# Altium schematic sheet 01_stm32.SchDoc: KART : STM32
size A4; DrawnBy: JNieto; DocumentNumber: 2; Revision: 1.0; SheetNumber: 2; SheetTotal: 10; Version: V 1.0.0
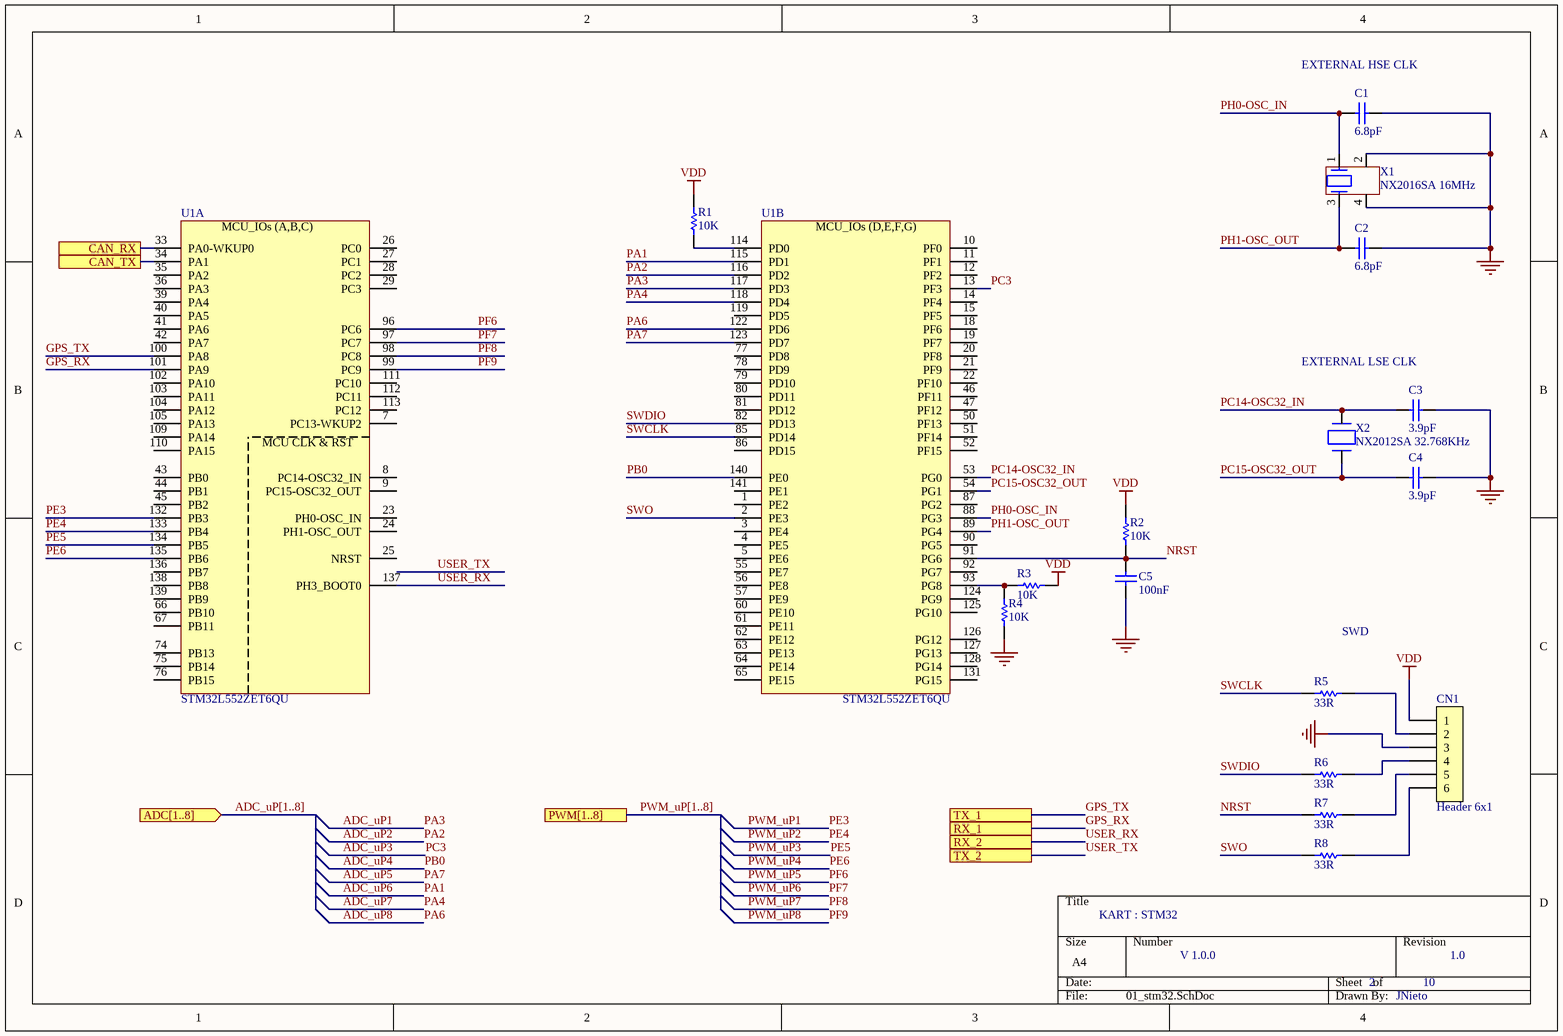
[diagram p0: 01_stm32.SchDoc]

## Parts
C1  value 6.8pF  [C0603]  (hidden comment: Capacitor)
C2  value 6.8pF  [C0603]  (hidden comment: Capacitor)
C3  value 3.9pF  [C0603]  (hidden comment: Capacitor)
C4  value 3.9pF  [C0603]  (hidden comment: Capacitor)
C5  value 100nF  [C0603]
CN1  value Header 6x1  [CON_SAMTEC_TSW-106-07-X-S]  (hidden comment: MCD-00212)
R1  value 10K  [R0603]
R2  value 10K  [R0603]
R3  value 10K  [R0603]
R4  value 10K  [R0603]
R5  value 33R  [R0603]  (hidden comment: MCD-00190)
R6  value 33R  [R0603]  (hidden comment: MCD-00190)
R7  value 33R  [R0603]  (hidden comment: MCD-00190)
R8  value 33R  [R0603]  (hidden comment: MCD-00190)
U1  STM32L552ZET6QU  [ICC_LQFP144_20X20_P050]  (parts A,B of 3)
X1  value NX2016SA 16MHz  [CRY_NX2016SA_4P]  (hidden comment: XTAL_4_PINS)
X2  value NX2012SA 32.768KHz  [CRY_NX2012SA_2P]  (hidden comment: XTAL_2_PINS)

## Ports
ADC[1..8] (in), CAN_RX, CAN_TX, PWM[1..8], RX_1, RX_2, TX_1, TX_2

## Nets
GND: C1.2 C2.2 C3.2 C4.2 C5.1 CN1.3 R4.2 X1.2 X1.4
VDD: CN1.1 R1.1 R2.1 R3.2
ADC_uP1: U1.117(PD3)  [also labelled PA3]
ADC_uP2: U1.116(PD2)  [also labelled PA2]
ADC_uP3: U1.13(PF3)  [also labelled PC3]
ADC_uP4: U1.140(PE0)  [also labelled PB0]
ADC_uP5: U1.123(PD7)  [also labelled PA7]
ADC_uP6: U1.115(PD1)  [also labelled PA1]
ADC_uP7: U1.118(PD4)  [also labelled PA4]
ADC_uP8: U1.122(PD6)  [also labelled PA6]
CAN_RX: U1.33(PA0-WKUP0) ; port CAN_RX
CAN_TX: U1.34(PA1) ; port CAN_TX
GPS_RX: U1.101(PA9) ; port RX_1
GPS_TX: U1.100(PA8) ; port TX_1
NRST: C5.2 R2.2 R7.1 U1.91(PG6)
PC14-OSC32_IN: C3.1 U1.53(PG0) X2.2(X2)
PC15-OSC32_OUT: C4.1 U1.54(PG1) X2.1(X1)
PE3: U1.132(PB3)  [also labelled PWM_uP1]
PE4: U1.133(PB4)  [also labelled PWM_uP2]
PE5: U1.134(PB5)  [also labelled PWM_uP3]
PE6: U1.135(PB6)  [also labelled PWM_uP4]
PF6: U1.96(PC6)  [also labelled PWM_uP5]
PF7: U1.97(PC7)  [also labelled PWM_uP6]
PF8: U1.98(PC8)  [also labelled PWM_uP7]
PF9: U1.99(PC9)  [also labelled PWM_uP8]
PH0-OSC_IN: C1.1 U1.88(PG3) X1.1
PH1-OSC_OUT: C2.1 U1.89(PG4) X1.3
SWCLK: R5.1 U1.85(PD14)
SWDIO: R6.1 U1.82(PD13)
SWO: R8.1 U1.2(PE3)
USER_RX: U1.137(PH3_BOOT0) ; port RX_2
USER_TX: port TX_2
NetCN1_2: CN1.2 R5.2
NetCN1_4: CN1.4 R6.2
NetCN1_5: CN1.5 R7.2
NetCN1_6: CN1.6 R8.2
NetR1_2: R1.2 U1.114(PD0)
NetR3_1: R3.1 R4.1 U1.93(PG8)

Not connected (* = marked no-connect by the designer): U1 1(PE2) 3(PE4) 4(PE5) 5(PE6) 7(PC13-WKUP2) 8(PC14-OSC32_IN) 9(PC15-OSC32_OUT) 10(PF0) 11(PF1) 12(PF2) 14(PF4) 15(PF5) 18(PF6) 19(PF7) 20(PF8) 21(PF9) 22(PF10) 23(PH0-OSC_IN) 24(PH1-OSC_OUT) 25(NRST) 26(PC0) 27(PC1) 28(PC2) 29(PC3) 35(PA2) 36(PA3) 39(PA4) 40(PA5) 41(PA6) 42(PA7) 43(PB0) 44(PB1) 45(PB2) 46(PF11) 47(PF12) 50(PF13) 51(PF14) 52(PF15) 55(PE7) 56(PE8) 57(PE9) 60(PE10) 61(PE11) 62(PE12) 63(PE13) 64(PE14) 65(PE15) 66(PB10) 67(PB11) 74(PB13) 75(PB14) 76(PB15) 77(PD8) 78(PD9) 79(PD10) 80(PD11) 81(PD12) 86(PD15) 87(PG2) 90(PG5) 92(PG7) 102(PA10) 103(PA11) 104(PA12) 105(PA13) 109(PA14) 110(PA15) 111(PC10) 112(PC11) 113(PC12) 119(PD5) 124(PG9) 125(PG10) 126(PG12) 127(PG13) 128(PG14) 131(PG15) 136(PB7) 138(PB8) 139(PB9) 141(PE1)

## Buses and harness runs
bus ADC_uP[1..8] = port ADC[1..8]
bus PWM_uP[1..8] = port PWM[1..8]

## Notes on the sheet
- (near C1) EXTERNAL HSE CLK
- EXTERNAL LSE CLK
- SWD
- (in symbol MCD-01055, part A) MCU_IOs (A,B,C); MCU CLK & RST
- (in symbol MCD-01055, part B) MCU_IOs (D,E,F,G)

## Library data of the parts
C1 C2 = MCD-00674: Capacitor, MLCC, 6.8pF, 50V, NPO, +-0.25pF, 0402, T=0.5mm; Manufacturer_Part_Number: CC0402CRNPO9BN6R8; Manufacturer: YAGEO; Provided_By: Subcon; Initial_Board_Reference: MB1319; Internal_Part_Number: MCD-00674; Status: Released; Part_Type: Capacitor; Package: C0402; ComponentLink1Description: Datasheet; ComponentLink1URL: http://tunmcdsvn.tun.st.com/Component_Datasheet_Library/Trunk/Capacitors/Yageo_Capacitor_NP0_16V-to-50V
C3 C4 = MCD-00556: Capacitor, MLCC, 3.9pF, 50V, NPO, +-0.25pF, 0402, T=0,5mm; Manufacturer_Part_Number: CC0402CRNPO9BN3R9; Manufacturer: YAGEO; ECCN_US: EAR99; ECCN_EU: NEC; Provided_By: SUBCO; Internal_Part_Number: MCD-00556; Status: Released; Part_Type: Capacitor; Package: C0402; ComponentLink1Description: Datasheet; ComponentLink1URL: http://tunmcdsvn.tun.st.com/Component_Datasheet_Library/Trunk/Capacitors/Yageo_Capacitor_NP0_16V-to-50V
C5 = MCD-00211: Capacitor, MLCC, 100nF, 16V, X7R, 10%, 0603, T=0,8mm; Manufacturer_Part_Number: CC0603KRX7R7BB104; Manufacturer: YAGEO; Provided_By: Subcon; Initial_Board_Reference: MB1319; Internal_Part_Number: MCD-00211; ECCN_US: n/a; ECCN_EU: n/a; ComponentLink1Description: Datasheet; Status: Released; Part_Type: Capacitor; Package: C0603; ComponentLink1URL: http://tunmcdsvn.tun.st.com/Component_Datasheet_Library/Trunk/Capacitors/Yageo_Multilayer_Capacitor_X7R_series_100pF_to_22uF
CN1 = MCD-00212: Header, 6x1, 2,54mm, VR, TH, Height 5.84mm/2.54mm; Manufacturer_Part_Number: TSW-106-07-x-S; Manufacturer: SAMTEC; Part_Type: Connector; Provided_By: Subcon; Initial_Board_Reference: MB1319; Internal_Part_Number: MCD-00212; ECCN_US: n/a; ECCN_EU: n/a; ComponentLink1Description: Datasheet; Status: Released; ComponentLink1URL: http://tunmcdsvn.tun.st.com/Component_Datasheet_Library/Trunk/Connectors/Samtec_TSW-HTSW-series
R1-R4 = MCD-00220: Resistor,10K,0603,1%,1/10W; Manufacturer_Part_Number: RC0603FR-0710KL; Manufacturer: YAGEO; Provided_By: Subcon; Initial_Board_Reference: MB1319; Internal_Part_Number: MCD-00220; Status: Released; Part_Type: Resistor; ComponentLink1Description: Datasheet; ECCN_US: n/a; ECCN_EU: n/a; Package: R0603; ComponentLink1URL: http://tunmcdsvn.tun.st.com/Component_Datasheet_Library/Trunk/Resistors/Yageo_Resistor_RC0603-series
R5-R8 = MCD-00190: Resistor,33R,0603,1%,1/10W; Manufacturer_Part_Number: RC0603FR-0722RL; Manufacturer: YAGEO; Provided_By: Subcon; Internal_Part_Number: MCD-00190; ComponentLink1Description: Datasheet; ECCN_US: n/a; ECCN_EU: n/a; Status: Released; Part_Type: Resistor; Package: R0603; ComponentLink1URL: http://tunmcdsvn.tun.st.com/Component_Datasheet_Library/Trunk/Resistors/Yageo_Resistor_RC0603-series
U1 = MCD-01055: STM32L552ZET6Q MCU,LQFP144 20x20, 0.5, no AES, Q for Int SMPS; Part_Type: IC; Manufacturer: STMICROELECTRONICS; BMS_Part_Number: 9175310; ECCN_US: 3A991A2; ECCN_EU: NEC; Provided_By: SUBCO with ST control; Internal_Part_Number: MCD-01055; Value: STM32L552ZET6QU; Status: Released; Manufacturer_Part_Number: STM32L552ZET6QU; Package: LQFP144; ComponentLink1Description: Datasheet; ComponentLink1URL: http://tunmcdsvn.tun.st.com/Component_Datasheet_Library/Trunk/IC/STM_STM32L552ZET6QU
X1 = MCD-01476: Crystal 16 MHz, 8pF, -+20 PPM, R=200Ω, SMD; Part_Type: Crystal_Osc; Manufacturer_Part_Number: NX2016SA 16 MHz EXS00A-CS07826; Manufacturer: NDK; Provided_By: ST; Initial_Board_Reference: MB1373; Item Type: Item; Path: ws/MCD_ApplicationBoards/Lists/MCDPARTSdatabase; Internal_Part_Number: MCD-01476; Status: Symbol available; Package: NX2016SA; ComponentLink1Description: Datasheet; ComponentLink1URL: http://tunmcdsvn.tun.st.com/Component_Datasheet_Library/Trunk/Crystal_Osc/NDK_NX2016SA 16MHz EXS00A-CS07826 (EXS10B-21237)
X2 = MCD-01479: Crystal 32.768kHz, 6pF, -+20PPM, R=80K, SMD; Part_Type: Crystal_Osc; Manufacturer_Part_Number: NX2012SA 32.768KHz EXS00A-MU00527; Manufacturer: NDK; Provided_By: SUBCO; Initial_Board_Reference: MB1373; Item Type: Item; Path: ws/MCD_ApplicationBoards/Lists/MCDPARTSdatabase; Internal_Part_Number: MCD-01479; Status: Checked; Package: NX2012SA; ComponentLink1Description: Datasheet; ComponentLink1URL: http://tunmcdsvn.tun.st.com/Component_Datasheet_Library/Trunk/Crystal_Osc/NDK_NX2012SA 32.768KHz EXS00A-MU00527